# Altium schematic sheet leds.SchDoc
size A; SheetNumber: 3; SheetTotal: 3
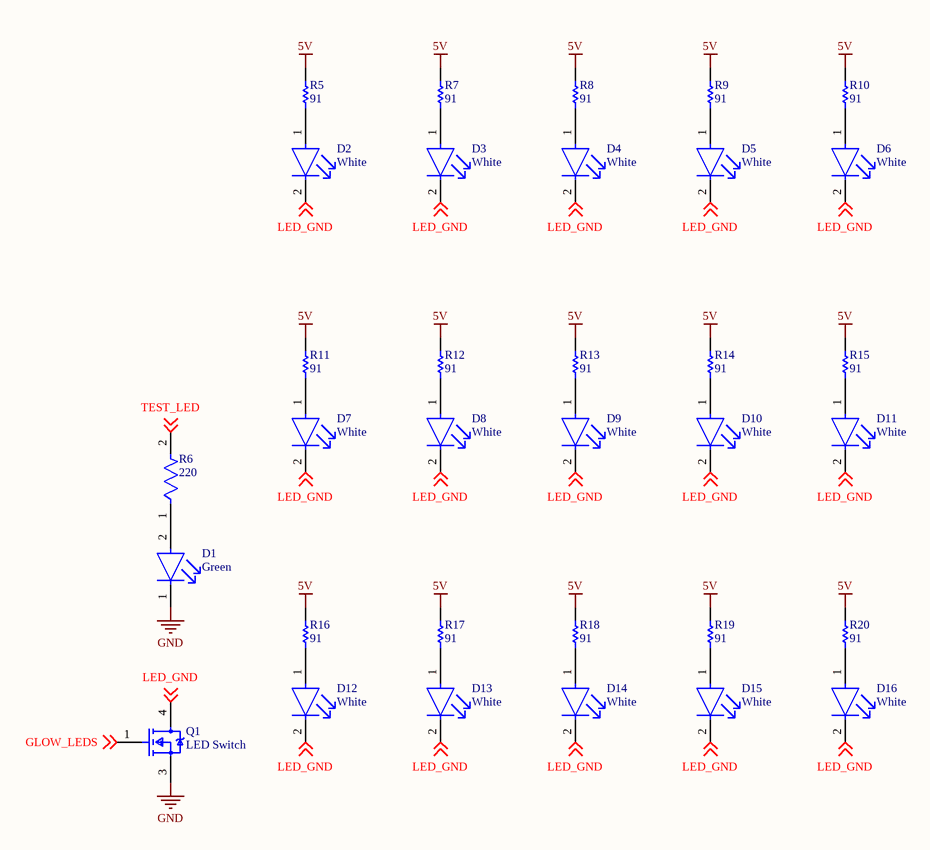
[diagram p0: leds.SchDoc]

## Parts
D1  Green  [FP-APTD3216CGCK-MFG]
D2  White  [FP-QBLP650-IW-MFG]
D3  White  [FP-QBLP650-IW-MFG]
D4  White  [FP-QBLP650-IW-MFG]
D5  White  [FP-QBLP650-IW-MFG]
D6  White  [FP-QBLP650-IW-MFG]
D7  White  [FP-QBLP650-IW-MFG]
D8  White  [FP-QBLP650-IW-MFG]
D9  White  [FP-QBLP650-IW-MFG]
D10  White  [FP-QBLP650-IW-MFG]
D11  White  [FP-QBLP650-IW-MFG]
D12  White  [FP-QBLP650-IW-MFG]
D13  White  [FP-QBLP650-IW-MFG]
D14  White  [FP-QBLP650-IW-MFG]
D15  White  [FP-QBLP650-IW-MFG]
D16  White  [FP-QBLP650-IW-MFG]
Q1  LED Switch  [FP-PG-TO263-3-MFG]
R5  91  [RESC2013X70X40NL20T20]
R6  220  [FP-CRCW0805-e3-MFG]
R7  91  [RESC2013X70X40NL20T20]
R8  91  [RESC2013X70X40NL20T20]
R9  91  [RESC2013X70X40NL20T20]
R10  91  [RESC2013X70X40NL20T20]
R11  91  [RESC2013X70X40NL20T20]
R12  91  [RESC2013X70X40NL20T20]
R13  91  [RESC2013X70X40NL20T20]
R14  91  [RESC2013X70X40NL20T20]
R15  91  [RESC2013X70X40NL20T20]
R16  91  [RESC2013X70X40NL20T20]
R17  91  [RESC2013X70X40NL20T20]
R18  91  [RESC2013X70X40NL20T20]
R19  91  [RESC2013X70X40NL20T20]
R20  91  [RESC2013X70X40NL20T20]

## Nets
5V: R5.2 R7.2 R8.2 R9.2 R10.2 R11.2 R12.2 R13.2 R14.2 R15.2 R16.2 R17.2 R18.2 R19.2 R20.2
GND: D1.1(C) Q1.3(S)
GLOW_LEDS: Q1.1(G) ; off-sheet GLOW_LEDS
LED_GND: D2.2(C) D3.2(C) D4.2(C) D5.2(C) D6.2(C) D7.2(C) D8.2(C) D9.2(C) D10.2(C) D11.2(C) D12.2(C) D13.2(C) D14.2(C) D15.2(C) D16.2(C) Q1.4(D) ; off-sheet LED_GND
TEST_LED: R6.2 ; off-sheet TEST_LED
NetD1_2: D1.2(A) R6.1
NetD2_1: D2.1(A) R5.1
NetD3_1: D3.1(A) R7.1
NetD4_1: D4.1(A) R8.1
NetD5_1: D5.1(A) R9.1
NetD6_1: D6.1(A) R10.1
NetD7_1: D7.1(A) R11.1
NetD8_1: D8.1(A) R12.1
NetD9_1: D9.1(A) R13.1
NetD10_1: D10.1(A) R14.1
NetD11_1: D11.1(A) R15.1
NetD12_1: D12.1(A) R16.1
NetD13_1: D13.1(A) R17.1
NetD14_1: D14.1(A) R18.1
NetD15_1: D15.1(A) R19.1
NetD16_1: D16.1(A) R20.1

## Library data of the parts
D1 = CMP-2000-05792-2: LED GREEN CLEAR 2SMD; MPN: APTD3216CGCK; Forward Voltage: 2.1V; Forward Current: 20mA; Luminous Intensity: 300mcd; Number of LEDs: 1; Dominant Wavelength: 570nm; Viewing Angle: 50°; Value: Green LED; Lead Free: Lead Free; Lens Color: Clear; Mount: Surface Mount; Package Quantity: 2000; Height: 1.8mm; Number of Pins: 2; Test Current: 20mA; Case Code (Metric): 3216; Case/Package: 1206; Case Code (Imperial): 1206; Illumination Color: Green; Color: Green; Width: 1.6mm; Packaging: Tape and Reel; Min Operating Temperature: -40°C; Lens Style: Clear; Max Operating Temperature: 85°C; Length: 3.2mm; Parameter 2: *
D2-D16 = CMP-113271-000009-1: LED WHITE CLEAR 1206 SMD; MPN: QBLP650-IW; Lens Size: 1.6mm; Test Current: 20mA; Lens Style: Flat; Lens Color: Colorless; Luminous Intensity: 250mcd; Forward Voltage: 3.3V; Packaging: Tape and Reel; Height: 1.1mm; Case/Package: 1206; Mount: Surface Mount; Length: 3.2mm; Case Code (Imperial): 1206; Lens Transparency: Clear; Color: White; Width: 1.6mm; Case Code (Metric): 3216
Q1 = CMP-32901-000039-1: MOSFET N-CH 100V 17A D2PAK; Manufacturer Part Number: IRF530NSTRLPBF; Manufacturer: Infineon; Reverse Recovery Time: 93ns; Turn On Delay Time: 9.2ns; Number Of Channels: 1; Gate Charge At Vgs: 37nC @ 10V; Max Junction Temp: +175°C; Drain To Source Resistance: 90mΩ; Pulse Drain Current: 60A; Max Forward Diode Voltage: 1.3V; Threshold Vgs Min: 2V; Threshold Vgs Max: 4V; Depletion Mode: False; Rthja Max: 40°C/W; Reverse Recovery Charge: 320nC; Turn Off Delay Time: 35ns; Gate To Source Voltage: 20V; Power Dissipation: 3.8W; Standoff Height: 0mm; Input Capacitace At Vds: 920pF @ 25V; Height: 5.084mm; RoHS: TRUE; Device Class L2: Transistors; Lead Free: Yes; Automotive: No; Category: Trans; Footprint Url: https://www.infineon.com/cms/en/product/packages/PG-TO263/PG-TO263-3-901/; ComponentLink2Description: Datasheet; Temperature Range Low: -55°C; Drain To Source Voltage: 100V; Temperature: -55°C to +175°C; Device Class L1: Discrete Semiconductors; Number Of N Channels: 1; Continuous Drain Current: 17A; Temperature Range High: +175°C; Digikey Description: MOSFET N-CH 100V 17A D2PAK; Drain To Source Breakdown Voltage: 100V; ComponentLink2URL: https://www.infineon.com/dgdl/irf530nspbf.pdf?fileId=5546d462533600a4015355e38eb4199c; Device Class L3: MOSFETs; Octopart: https://octopart.com/irf530nstrlpbf-infineon-65873402; Package: PG-TO263-3; MPN: IRF530NSTRLPBF
R5 R7-R20 = CMP-2001-00454-1: Part Number: ERJ-6GEYJ910V; Manufacturer: Panasonic; MPN: ERJ-6GEYJ910V
R6 = CMP-2001-03682-2: RES Thick Film, 220Ω, 1%, 0.125W, 100ppm/°C, 0805; MPN: CRCW0805220RFKEA; Max Power Dissipation: 125mW; Voltage Rating: 150V; Resistance: 220R; Packaging: Tape and Reel; Termination: SMD/SMT; Height: 0.45mm; Package Quantity: 10; Width: 0.049inch; Min Operating Temperature: -55°C; Lead Free: Lead Free; Military Standard: Not; Mount: Surface Mount; Max Operating Temperature: 155°C; Voltage Rating (DC): 150V; Composition: Thick Film; Case/Package: 0805; Length: 2mm; Weight: 0.000194oz; Case Code (Metric): 2012; Number of Terminations: 2; Case Code (Imperial): 0805; Radiation Hardening: No; Tolerance: 1%; Features: Automotive AEC-Q200; Power Rating: 125mW; Depth: 1.25mm; Contact Plating: Tin; Temperature Coefficient: 100ppm/°C